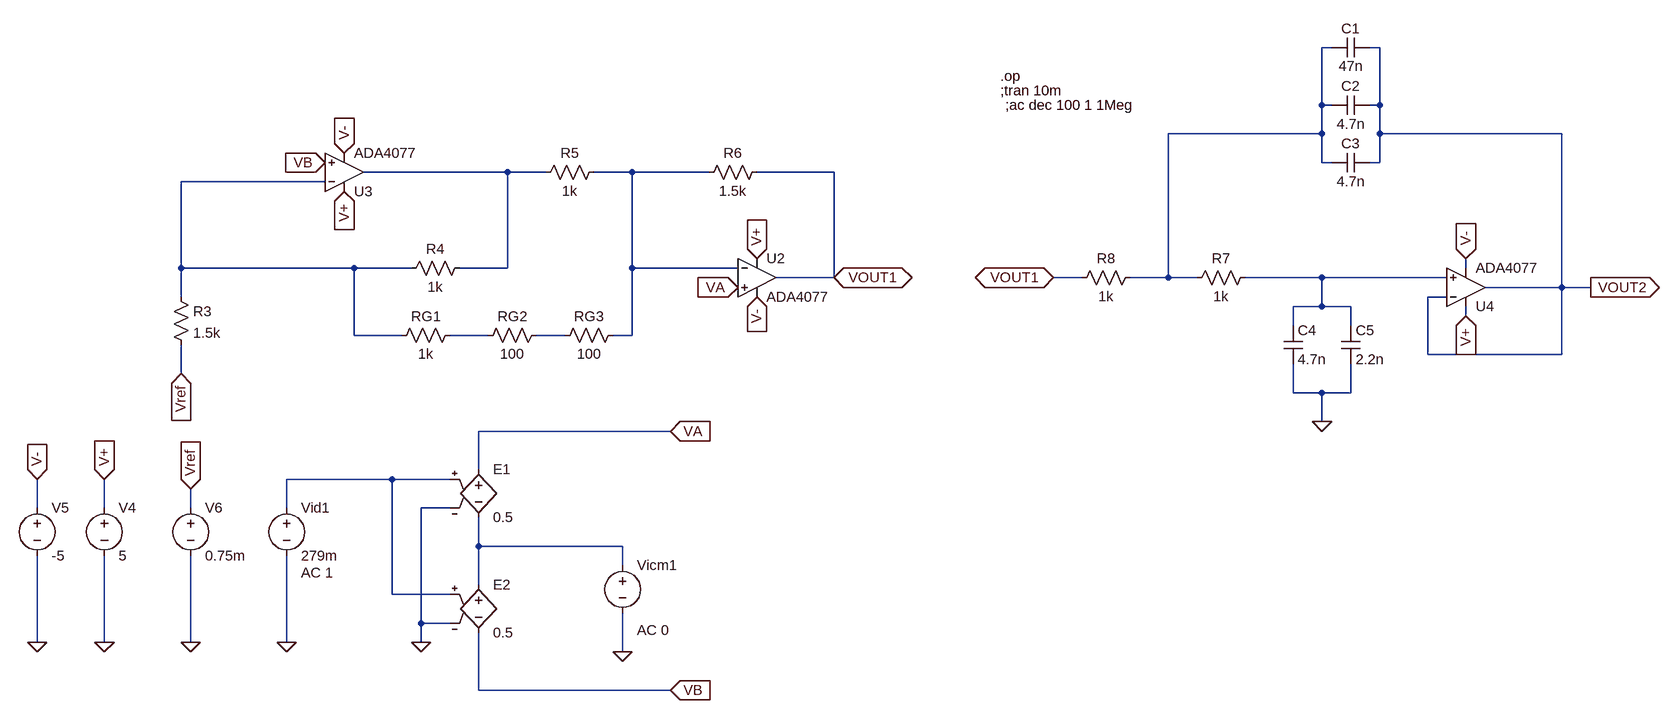
[diagram p0: schematic Etaj 2.asc]
Etaj 2.asc, the LTspice schematic file:
Version 4
SHEET 1 3228 920
WIRE 928 -224 912 -224
WIRE 1008 -224 992 -224
WIRE 912 -128 912 -224
WIRE 928 -128 912 -128
WIRE 1008 -128 1008 -224
WIRE 1008 -128 992 -128
WIRE 912 -80 912 -128
WIRE 912 -80 656 -80
WIRE 1008 -80 1008 -128
WIRE 1312 -80 1008 -80
WIRE 912 -32 912 -80
WIRE 928 -32 912 -32
WIRE 1008 -32 1008 -80
WIRE 1008 -32 992 -32
WIRE -1056 -16 -1296 -16
WIRE -992 -16 -1056 -16
WIRE -848 -16 -912 -16
WIRE -720 -16 -848 -16
WIRE -512 -16 -640 -16
WIRE -1360 0 -1600 0
WIRE -1600 144 -1600 0
WIRE -1312 144 -1600 144
WIRE -1216 144 -1312 144
WIRE -1056 144 -1056 -16
WIRE -1056 144 -1136 144
WIRE -848 144 -848 -16
WIRE -672 144 -848 144
WIRE 1152 144 1152 128
WIRE -512 160 -512 -16
WIRE -512 160 -608 160
WIRE 512 160 464 160
WIRE 656 160 656 -80
WIRE 656 160 592 160
WIRE 704 160 656 160
WIRE 912 160 784 160
WIRE 1120 160 912 160
WIRE 1312 176 1312 -80
WIRE 1312 176 1184 176
WIRE 1360 176 1312 176
WIRE -1600 192 -1600 144
WIRE 1120 192 1088 192
WIRE 912 208 912 160
WIRE 912 208 864 208
WIRE 960 208 912 208
WIRE 1152 224 1152 208
WIRE 864 240 864 208
WIRE 960 240 960 208
WIRE -1312 256 -1312 144
WIRE -1232 256 -1312 256
WIRE -1088 256 -1152 256
WIRE -960 256 -1008 256
WIRE -848 256 -848 144
WIRE -848 256 -880 256
WIRE 1088 288 1088 192
WIRE 1312 288 1312 176
WIRE 1312 288 1088 288
WIRE -1600 320 -1600 272
WIRE 864 352 864 304
WIRE 912 352 864 352
WIRE 960 352 960 304
WIRE 960 352 912 352
WIRE 912 400 912 352
WIRE -784 416 -1104 416
WIRE -1104 480 -1104 416
WIRE -1248 496 -1424 496
WIRE -1152 496 -1248 496
WIRE -1840 544 -1840 496
WIRE -1728 544 -1728 496
WIRE -1584 544 -1584 512
WIRE -1424 544 -1424 496
WIRE -1152 544 -1200 544
WIRE -1104 608 -1104 560
WIRE -864 608 -1104 608
WIRE -864 640 -864 608
WIRE -1104 672 -1104 608
WIRE -1248 688 -1248 496
WIRE -1152 688 -1248 688
WIRE -1200 736 -1200 544
WIRE -1152 736 -1200 736
WIRE -1840 768 -1840 624
WIRE -1728 768 -1728 624
WIRE -1584 768 -1584 624
WIRE -1424 768 -1424 624
WIRE -1200 768 -1200 736
WIRE -864 784 -864 720
WIRE -1104 848 -1104 752
WIRE -784 848 -1104 848
FLAG -1728 768 0
FLAG -1840 768 0
FLAG -1728 496 V+
IOPIN -1728 496 In
FLAG -1840 496 V-
IOPIN -1840 496 In
FLAG -640 192 V-
IOPIN -640 192 In
FLAG -1328 -48 V-
IOPIN -1328 -48 In
FLAG -640 128 V+
IOPIN -640 128 In
FLAG -1328 16 V+
IOPIN -1328 16 In
FLAG -672 176 VA
IOPIN -672 176 In
FLAG -1360 -32 VB
IOPIN -1360 -32 In
FLAG -1424 768 0
FLAG -1200 768 0
FLAG -864 784 0
FLAG -784 416 VA
IOPIN -784 416 In
FLAG -784 848 VB
IOPIN -784 848 In
FLAG -1584 512 Vref
IOPIN -1584 512 In
FLAG -1600 320 Vref
IOPIN -1600 320 In
FLAG -1584 768 0
FLAG 1360 176 VOUT2
IOPIN 1360 176 Out
FLAG 1152 224 V+
IOPIN 1152 224 In
FLAG 1152 128 V-
IOPIN 1152 128 In
FLAG -512 160 VOUT1
IOPIN -512 160 BiDir
FLAG 464 160 VOUT1
IOPIN 464 160 BiDir
FLAG 912 400 0
DATAFLAG -512 160 ""
SYMBOL res -1616 176 R0
SYMATTR InstName R3
SYMATTR Value 1.5k
SYMBOL res -1120 128 R90
WINDOW 0 0 56 VBottom 2
WINDOW 3 32 56 VTop 2
SYMATTR InstName R4
SYMATTR Value 1k
SYMBOL res -896 -32 R90
WINDOW 0 0 56 VBottom 2
WINDOW 3 32 56 VTop 2
SYMATTR InstName R5
SYMATTR Value 1k
SYMBOL res -624 -32 R90
WINDOW 0 0 56 VBottom 2
WINDOW 3 32 56 VTop 2
SYMATTR InstName R6
SYMATTR Value 1.5k
SYMBOL res -1136 240 R90
WINDOW 0 0 56 VBottom 2
WINDOW 3 32 56 VTop 2
SYMATTR InstName RG1
SYMATTR Value 1k
SYMBOL voltage -1728 528 R0
WINDOW 123 24 44 Left 2
WINDOW 39 0 0 Left 0
SYMATTR InstName V4
SYMATTR Value 5
SYMBOL voltage -1840 528 R0
WINDOW 123 24 44 Left 2
WINDOW 39 0 0 Left 0
SYMATTR InstName V5
SYMATTR Value -5
SYMBOL e -1104 464 R0
SYMATTR InstName E1
SYMATTR Value 0.5
SYMBOL e -1104 656 R0
SYMATTR InstName E2
SYMATTR Value 0.5
SYMBOL voltage -864 624 R0
WINDOW 123 24 124 Left 2
WINDOW 39 0 0 Left 0
SYMATTR Value2 AC 0
SYMATTR InstName Vicm1
SYMATTR Value ""
SYMBOL voltage -1424 528 R0
WINDOW 123 24 124 Left 2
WINDOW 39 0 0 Left 0
SYMATTR Value2 AC 1
SYMATTR InstName Vid1
SYMATTR Value 279m
SYMBOL voltage -1584 528 R0
WINDOW 123 0 0 Left 0
WINDOW 39 0 0 Left 0
SYMATTR InstName V6
SYMATTR Value 0.75m
SYMBOL res -992 240 R90
WINDOW 0 0 56 VBottom 2
WINDOW 3 32 56 VTop 2
SYMATTR InstName RG2
SYMATTR Value 100
SYMBOL res -864 240 R90
WINDOW 0 0 56 VBottom 2
WINDOW 3 32 56 VTop 2
SYMATTR InstName RG3
SYMATTR Value 100
SYMBOL OpAmps\\ADA4077 -640 96 R0
SYMATTR InstName U2
SYMBOL OpAmps\\ADA4077 -1328 48 M180
SYMATTR InstName U3
SYMBOL OpAmps\\ADA4077 1152 240 M180
SYMATTR InstName U4
SYMBOL res 800 144 R90
WINDOW 0 0 56 VBottom 2
WINDOW 3 32 56 VTop 2
SYMATTR InstName R7
SYMATTR Value 1k
SYMBOL res 608 144 R90
WINDOW 0 0 56 VBottom 2
WINDOW 3 32 56 VTop 2
SYMATTR InstName R8
SYMATTR Value 1k
SYMBOL cap 992 -240 R90
WINDOW 0 0 32 VBottom 2
WINDOW 3 32 32 VTop 2
SYMATTR InstName C1
SYMATTR Value 47n
SYMBOL cap 992 -144 R90
WINDOW 0 0 32 VBottom 2
WINDOW 3 32 32 VTop 2
SYMATTR InstName C2
SYMATTR Value 4.7n
SYMBOL cap 992 -48 R90
WINDOW 0 0 32 VBottom 2
WINDOW 3 32 32 VTop 2
SYMATTR InstName C3
SYMATTR Value 4.7n
SYMBOL cap 848 240 R0
SYMATTR InstName C4
SYMATTR Value 4.7n
SYMBOL cap 944 240 R0
SYMATTR InstName C5
SYMATTR Value 2.2n
TEXT 384 -128 Left 2 !;ac dec 100 1 1Meg
TEXT 376 -176 Left 2 !.op
TEXT 376 -152 Left 2 !;tran 10m

The netlist it stands for:
* Etaj 2.asc
R3 N004 Vref 1.5k
R4 N002 N004 1k
R5 N003 N002 1k
R6 VOUT1 N003 1.5k
RG1 N006 N004 1k
V4 V+ 0 5
V5 V- 0 -5
E1 VA N009 N008 0 0.5
E2 N009 VB N008 0 0.5
Vicm1 N009 0 AC 0
Vid1 N008 0 279m AC 1
V6 Vref 0 0.75m
RG2 N007 N006 100
RG3 N003 N007 100
XU2 VA N003 V+ V- VOUT1 ADA4077  ; pins In+ In- V+ V- OUT
XU3 VB N004 V+ V- N002 ADA4077  ; pins In+ In- V+ V- OUT
XU4 N005 VOUT2 V+ V- VOUT2 ADA4077  ; pins In+ In- V+ V- OUT
R7 N005 N001 1k
R8 N001 VOUT1 1k
C1 VOUT2 N001 47n
C2 VOUT2 N001 4.7n
C3 VOUT2 N001 4.7n
C4 N005 0 4.7n
C5 N005 0 2.2n
;ac dec 100 1 1Meg
.op
;tran 10m
.backanno
.end